# EasyEDA Pro project Charger Splitter.eprj, schematic Schematic2
Board Name: Board2; Create Date: 2025-09-04; Page Name: P1; Project Name: Charger Splitter; Schematic Name: Schematic2; Update Date: 2025-09-14; Company: EasyEDA.com; Page Size: A4; Version: V1.0
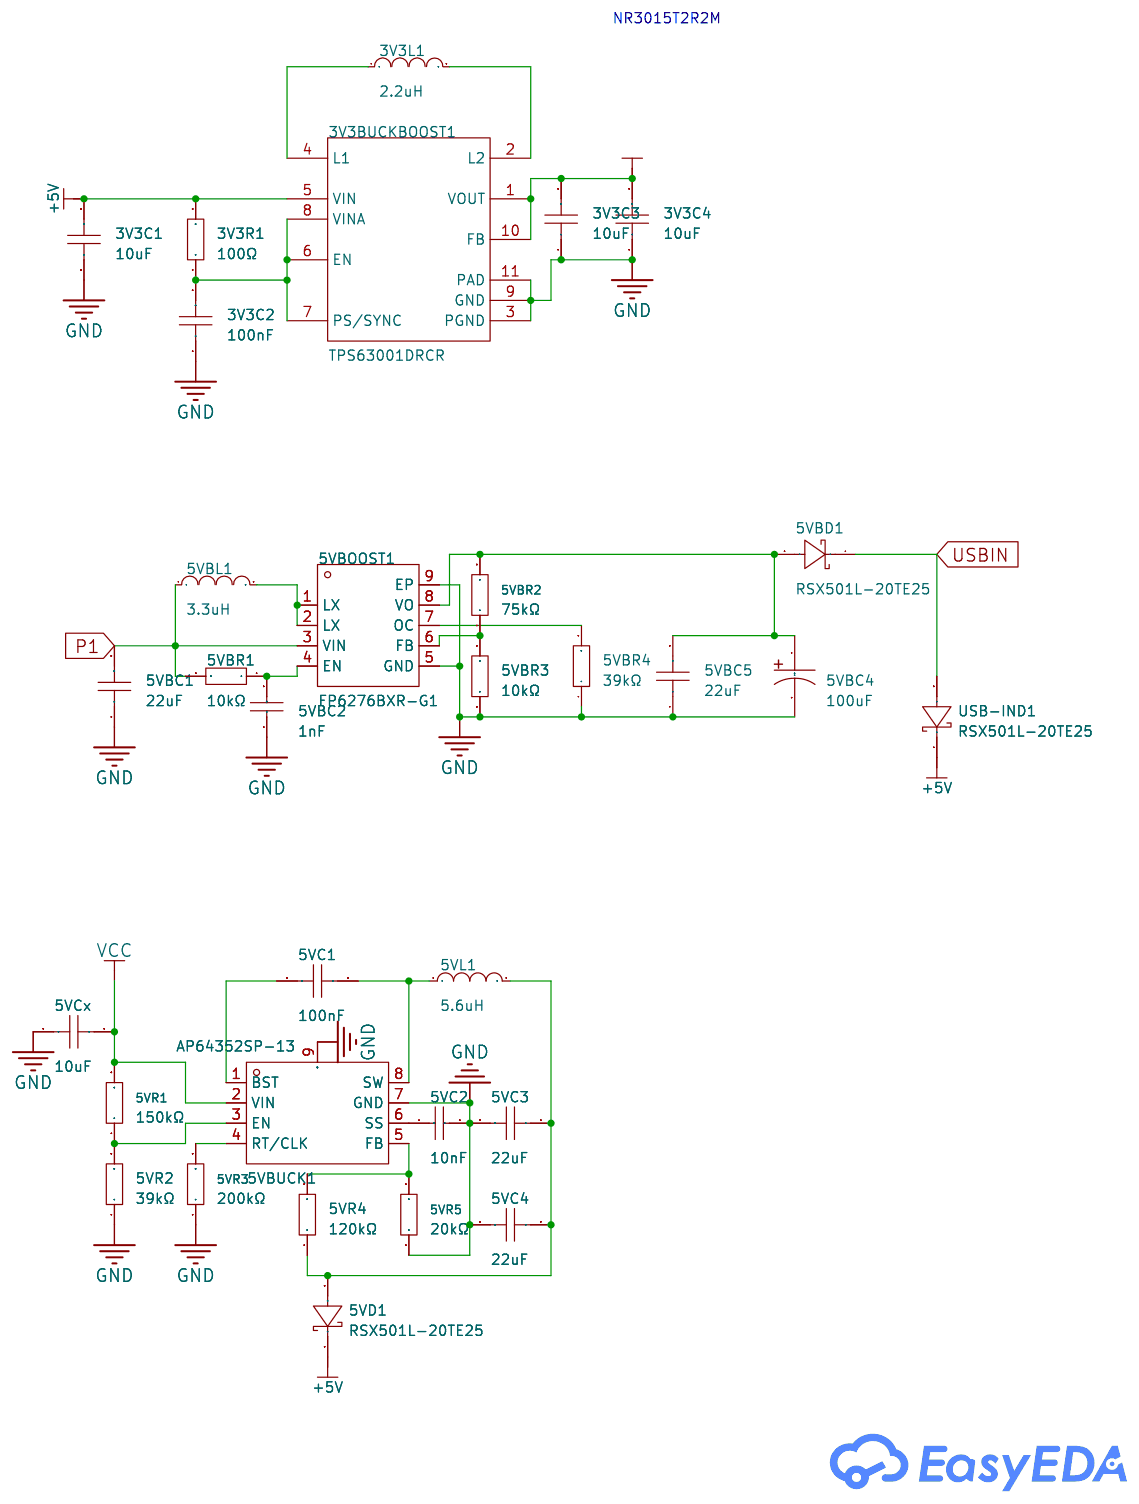
[diagram p1: schematic sheet]

## Parts
3V3BUCKBOOST1  TPS63001DRCR  [VSON-10_L3.0-W3.0-P0.50-TL-EP_TPS62410DRCR]
3V3C1  10uF  [C0805]
3V3C2  100nF  [C0805]
3V3C3  10uF  [C0805]
3V3C4  10uF  [C0805]
3V3L1  2.2uH  [IND-SMD_L3.0-W3.0_NR3010]
3V3R1  100Ω  [R0805]
5VBC1  22uF  [C0805]
5VBC2  1nF  [C0805]
5VBC4  100uF  [CAP-SMD_L3.5-W2.8-R-RD]
5VBC5  22uF  [C0805]
5VBD1  RSX501L-20TE25  [SMA_L4.5-W2.6-LS5.0-RD]
5VBL1  3.3uH  [IND-SMD_L7.0-W6.6]
5VBOOST1  FP6276BXR-G1  [SOP-8_L4.9-W3.9-P1.27-LS6.0-BL-EP]
5VBR1  10kΩ  [R0805]
5VBR2  75kΩ  [R0603]
5VBR3  10kΩ  [R0805]
5VBR4  39kΩ  [R0603]
5VBUCK1  AP64352SP-13  [SO-8_L4.9-W3.9-P1.27-LS6.0-BL-EP]
5VC1  100nF  [C0805]
5VC2  10nF  [C0805]
5VC3  22uF  [C0805]
5VC4  22uF  [C0805]
5VCx  10uF  [C0805]
5VD1  RSX501L-20TE25  [SMA_L4.5-W2.6-LS5.0-RD]
5VL1  5.6uH  [IND-SMD_L5.5-W5.3]
5VR1  150kΩ  [R0805]
5VR2  39kΩ  [R0603]
5VR3  200kΩ  [R0805]
5VR4  120kΩ  [R0603]
5VR5  20kΩ  [R0805]
USB-IND1  RSX501L-20TE25  [SMA_L4.5-W2.6-LS5.0-RD]

## Library data of the parts
3V3BUCKBOOST1 = TPS63001DRCR: Function:Boost type Output Type:Fixed Voltage - Supply:1.8V~5.5V Voltage - Supply:1.8V~5.5V Output Voltage:3.3V Output Voltage:3.3V Output Current:- Frequency - Switching:1.5MHz Frequency - Switching:1.5MHz Operating Temperature:-40℃~+85℃@(TA) Operating T; LCSC Part Name: 高效率单电感升降压转换器; Supplier Part: C28060; Manufacturer: TI(德州仪器); Supplier Footprint: VSON-10-EP(3x3); JLCPCB Part Class: Extended Part; Datasheet: https://www.ti.com/cn/lit/gpn/tps63001; Supplier: LCSC; Function: Boost type; Output Type: Fixed; Voltage - Supply: 1.8V~5.5V; Output Voltage: 3.3V; Frequency - Switching: 1.5MHz; Operating Temperature: -40℃~+85℃@(TA); Synchronous Rectifier: Yes; Number of Outputs: 1; Topology: Step-down-Boost; Switch tube (built-in/external): Built-in
3V3C1 3V3C3 3V3C4 = CL21A106KAYNNNE_C15850: Capacitance: Tolerance:±10% Tolerance:±10% Voltage Rated: Temperature Coefficient:; LCSC Part Name: 10uF ±10% 25V; Supplier Part: C15850; Manufacturer: SAMSUNG(三星); Manufacturer Part: CL21A106KAYNNNE; Supplier Footprint: 0805; JLCPCB Part Class: Basic Part; Datasheet: https://atta.szlcsc.com/upload/public/pdf/source/20160218/1457707763339.pdf; Supplier: LCSC; Tolerance: ±10%
3V3C2 5VC1 = CC0805KRX7R9BB104: Capacitance: Tolerance:±10% Tolerance:±10% Voltage Rated: Temperature Coefficient:; LCSC Part Name: 100nF ±10% 50V; Supplier Part: C49678; Manufacturer: YAGEO(国巨); Supplier Footprint: 0805; JLCPCB Part Class: Basic Part; Datasheet: https://atta.szlcsc.com/upload/public/pdf/source/20180224/C181747_15194369449651363981.pdf; Supplier: LCSC; Tolerance: ±10%
3V3L1 = NR3015T2R2M: LCSC Part Name: 2.2uH ±20% 1.48A 停产; Supplier Part: C86423; Manufacturer: TAIYO YUDEN(太诱); Supplier Footprint: SMD,3x3mm; JLCPCB Part Class: Extended Part; Datasheet: https://atta.szlcsc.com/upload/public/pdf/source/20210429/D283EEC4B2B32E0C06ACD7E308182B38.pdf; Supplier: LCSC; Tolerance: ±20%; Current - Saturation(Isat): 1.48A; DC Resistance(DCR): 72mΩ
3V3R1 = 0805W8F1000T5E_C17408: Type:Thick Film Resistors Resistance: Tolerance:±1% Tolerance:±1% Power(Watts): Overload Voltage (Max): Temperature Coefficient:±100ppm/℃ Temperature Coefficient:±100ppm/℃ Operating Temperature Range:-55℃~+155℃ Operating Temperature Range:-55℃~+155℃; LCSC Part Name: 100Ω ±1% 125mW 厚膜电阻; Supplier Part: C17408; Manufacturer: UNI-ROYAL(厚声); Manufacturer Part: 0805W8F1000T5E; Supplier Footprint: 0805; JLCPCB Part Class: Basic Part; Datasheet: https://atta.szlcsc.com/upload/public/pdf/source/20200306/C422600_1E6D84923E4A46A82E41ADD87F860B5C.pdf; Supplier: LCSC; Type: Thick Film Resistors; Tolerance: ±1%; Temperature Coefficient: ±100ppm/℃; Operating Temperature Range: -55℃~+155℃
5VBC1 5VBC5 5VC3 5VC4 = CL21A226MAQNNNE: LCSC Part Name: 22uF ±20% 25V; Supplier Part: C45783; Manufacturer: SAMSUNG(三星); Supplier Footprint: 0805; JLCPCB Part Class: Basic Part; Datasheet: https://item.szlcsc.com/datasheet/CL21A226MAQNNNE/46786.html; Supplier: LCSC; Tolerance: ±20%; Voltage Rating: 25V; Temperature Coefficient: X5R
5VBC2 = CL21B102KBCNNNC: Capacitance:1nF Tolerance:±10% Tolerance:±10% Voltage Rating:50V Temperature Coefficient:X7R; LCSC Part Name: 1nF ±10% 50V; Supplier Part: C46653; Manufacturer: SAMSUNG(三星); Supplier Footprint: 0805; JLCPCB Part Class: Basic Part; Datasheet: https://item.szlcsc.com/datasheet/CL21B102KBCNNNC/47657.html; Supplier: LCSC; Tolerance: ±10%; Voltage Rating: 50V; Temperature Coefficient: X7R
5VBC4 = CA45A-B-10V-100UF-K: Capacitance:100uF Tolerance:±10% Tolerance:±10% Voltage Rating:10V Operating Temperature:-55℃~+125℃ Operating Temperature:-55℃~+125℃; LCSC Part Name: 100uF ±10% 10V; Supplier Part: C2976906; Manufacturer: CEC(振华新云); Supplier Footprint: SMD,2.8x3.5mm; JLCPCB Part Class: Extended Part; Datasheet: https://atta.szlcsc.com/upload/public/pdf/source/20220222/C2C5F368BEBB90E653B4407F98E5644A.pdf; Supplier: LCSC; Tolerance: ±10%; Voltage Rating: 10V; Operating Temperature: -55℃~+125℃
5VBD1 5VD1 USB-IND1 = RSX501L-20TE25: Diode Configuration:Independent Voltage - Forward(Vf@If):390mV@3A Voltage - DC Reverse(Vr):20V Current - Rectified:5A Reverse Leakage Current (Ir):500uA@20V Non-Repetitive Peak Forward Surge Current:70A; LCSC Part Name: 电压:20V 电流:5A; Supplier Part: C329921; Manufacturer: ROHM(罗姆); Supplier Footprint: SMA; JLCPCB Part Class: Extended Part; Datasheet: https://item.szlcsc.com/datasheet/RSX501L-20TE25/309630.html; Supplier: LCSC; Diode Configuration: Independent; Voltage - Forward(Vf@If): 390mV@3A; Voltage - DC Reverse(Vr): 20V; Current - Rectified: 5A; Reverse Leakage Current (Ir): 500uA@20V; Non-Repetitive Peak Forward Surge Current: 70A
5VBL1 = FXL0630-3R3-M: Inductance: Tolerance:±20% Tolerance:±20% Rated Current: Saturation Current (Isat):9.5A DC Resistance (DCR): Type:Integrated molded inductor; LCSC Part Name: 3.3uH ±20% 9.5A; Supplier Part: C167219; Manufacturer: cjiang(长江微电); Supplier Footprint: SMD,6.6x7mm; JLCPCB Part Class: Extended Part; Datasheet: https://atta.szlcsc.com/upload/public/pdf/source/20240426/3189EA8206330E2108542F9E34E540E7.pdf; Supplier: LCSC; Tolerance: ±20%; Saturation Current (Isat): 9.5A; Type: Integrated molded inductor
5VBOOST1 = FP6276BXR-G1: Function:Boost type Output Type:Adjustable Input Voltage:2.4V~4.5V Input Voltage:2.4V~4.5V Output Voltage:- Output Voltage:- Output Current:6A Switching Frequency:500kHz Switching Frequency:500kHz Operating Temperature:-40℃~+85℃ Operating Temperature:-40℃; LCSC Part Name: 500kHz 6A高效同步PWM升压转换器; Supplier Part: C82652; Manufacturer: Advanced Analog Technology(类比); Supplier Footprint: SOP-8-EP; JLCPCB Part Class: Extended Part; Datasheet: https://atta.szlcsc.com/upload/public/pdf/source/20170315/1489573065037.pdf; Supplier: LCSC; Function: Boost type; Output Type: Adjustable; Input Voltage: 2.4V~4.5V; Output Current: 6A; Switching Frequency: 500kHz; Operating Temperature: -40℃~+85℃; Number of Outputs: 1; Topology: Boost; Quiescent Current (Iq): 280uA; Switch tube (built-in/external): Built-in
5VBR1 5VBR3 = 0805W8F1002T5E: Type:Thick Film Resistor Resistance:10kΩ Tolerance:±1% Tolerance:±1% Power(Watts):125mW Voltage-Supply(Max):150V Temperature Coefficient:±100ppm/℃ Temperature Coefficient:±100ppm/℃ Operating Temperature:-55℃~+155℃ Operating Temperature:-55℃~+155℃; LCSC Part Name: 10kΩ ±1% 125mW 厚膜电阻; Supplier Part: C17414; Manufacturer: UNI-ROYAL(厚声); Supplier Footprint: 0805; JLCPCB Part Class: Basic Part; Datasheet: https://item.szlcsc.com/datasheet/0805W8F1002T5E/18102.html; Supplier: LCSC; Type: Thick Film Resistor; Tolerance: ±1%; Power(Watts): 125mW; Voltage-Supply(Max): 150V; Temperature Coefficient: ±100ppm/℃; Operating Temperature: -55℃~+155℃
5VBR2 = 0603WAF7502T5E: LCSC Part Name: 75kΩ ±1% 100mW 厚膜电阻; Supplier Part: C23242; Manufacturer: UNI-ROYAL(厚声); Supplier Footprint: 0603; JLCPCB Part Class: Basic Part; Datasheet: https://item.szlcsc.com/datasheet/0603WAF7502T5E/23969.html; Supplier: LCSC; Type: Thick Film Resistor; Tolerance: ±1%; Power(Watts): 100mW; Voltage-Supply(Max): 75V; Temperature Coefficient: ±100ppm/℃; Operating Temperature: -55℃~+155℃
5VBR4 5VR2 = 0603WAF3902T5E: LCSC Part Name: 39kΩ ±1% 100mW 厚膜电阻; Supplier Part: C23153; Manufacturer: UNI-ROYAL(厚声); Supplier Footprint: 0603; JLCPCB Part Class: Basic Part; Datasheet: https://atta.szlcsc.com/upload/public/pdf/source/20200306/C422600_1E6D84923E4A46A82E41ADD87F860B5C.pdf; Supplier: LCSC; Type: Thick Film Resistors; Tolerance: ±1%; Temperature Coefficient: ±100ppm/℃; Operating Temperature Range: -55℃~+155℃
5VBUCK1 = AP64352SP-13: Function:Step-down type Output Type:- Voltage - Supply:3.8V~40V Voltage - Supply:3.8V~40V Output Voltage:- Output Voltage:- Output Current:3.5A Frequency - Switching:100kHz~2.2MHz Frequency - Switching:100kHz~2.2MHz Operating Temperature:-40℃~+85℃ Operati; LCSC Part Name: 3.8V至40V输入，3.5A低静态电流同步降压转换器; Supplier Part: C2071665; Manufacturer: DIODES(美台); Supplier Footprint: SO-8-EP; JLCPCB Part Class: Extended Part; Datasheet: https://atta.szlcsc.com/upload/public/pdf/source/20211207/6E33FF1B3B23FC2994BFD67B246A4BA4.pdf; Supplier: LCSC; Function: Step-down type; Voltage - Supply: 3.8V~40V; Output Current: 3.5A; Frequency - Switching: 100kHz~2.2MHz; Operating Temperature: -40℃~+85℃; Synchronous Rectifier: Yes; Number of Outputs: 1; Topology: Step-down; Switch tube (built-in/external): Built-in
5VC2 = CL21B103KBANNNC: Capacitance:10nF Tolerance:±10% Tolerance:±10% Voltage Rating:50V Temperature Coefficient:X7R; LCSC Part Name: 10nF ±10% 50V; Supplier Part: C1710; Manufacturer: SAMSUNG(三星); Supplier Footprint: 0805; JLCPCB Part Class: Basic Part; Datasheet: https://item.szlcsc.com/datasheet/CL21B103KBANNNC/2062.html; Supplier: LCSC; Tolerance: ±10%; Voltage Rating: 50V; Temperature Coefficient: X7R
5VCx = GRM21BR61H106KE43L: LCSC Part Name: 10uF ±10% 50V; Supplier Part: C440198; Manufacturer: muRata(村田); Supplier Footprint: 0805; JLCPCB Part Class: Basic Part; Datasheet: https://atta.szlcsc.com/upload/public/pdf/source/20230811/95AAE0C9AF55EDC31B7A4D8B733F534E.pdf; Supplier: LCSC; Tolerance: ±10%
5VL1 = FEXL0550A-5R6M: Inductance:5.6uH Tolerance:±20% Tolerance:±20% Current Rating:7.2A Current - Saturation(Isat):8.6A DC Resistance(DCR):24.2mΩ Type:- Ratings:AEC-Q200; LCSC Part Name: 5.6uH ±20% 8.6A 合金扁线超大电流，一体成型电感; Supplier Part: C5378514; Manufacturer: cjiang(长江微电); Supplier Footprint: SMD,5.5x5.3mm; JLCPCB Part Class: Extended Part; Datasheet: https://atta.szlcsc.com/upload/public/pdf/source/20240409/B9FA7ECCC3220F3F7C7BE8F7B1FCE238.pdf; Supplier: LCSC; Tolerance: ±20%; Current Rating: 7.2A; Current - Saturation(Isat): 8.6A; DC Resistance(DCR): 24.2mΩ; Ratings: AEC-Q200
5VR1 = 0805W8F1503T5E: LCSC Part Name: 150kΩ ±1% 125mW 厚膜电阻; Supplier Part: C17470; Manufacturer: UNI-ROYAL(厚声); Supplier Footprint: 0805; JLCPCB Part Class: Basic Part; Datasheet: https://atta.szlcsc.com/upload/public/pdf/source/20200306/C422600_1E6D84923E4A46A82E41ADD87F860B5C.pdf; Supplier: LCSC; Type: Thick Film Resistors; Tolerance: ±1%; Temperature Coefficient: ±100ppm/℃; Operating Temperature Range: -55℃~+155℃
5VR3 = 0805W8F2003T5E: Type:Thick Film Resistors Resistance:200kΩ Tolerance:±1% Tolerance:±1% Power(Watts): Overload Voltage (Max): Temperature Coefficient:±100ppm/℃ Temperature Coefficient:±100ppm/℃ Operating Temperature Range:-55℃~+155℃ Operating Temperature Range:-55℃~+155℃; LCSC Part Name: 200kΩ ±1% 125mW 厚膜电阻; Supplier Part: C17539; Manufacturer: UNI-ROYAL(厚声); Supplier Footprint: 0805; JLCPCB Part Class: Basic Part; Datasheet: https://atta.szlcsc.com/upload/public/pdf/source/20200306/C422600_1E6D84923E4A46A82E41ADD87F860B5C.pdf; Supplier: LCSC; Type: Thick Film Resistors; Tolerance: ±1%; Temperature Coefficient: ±100ppm/℃; Operating Temperature Range: -55℃~+155℃
5VR4 = 0603WAF1203T5E: LCSC Part Name: 120kΩ ±1% 100mW 厚膜电阻; Supplier Part: C25808; Manufacturer: UNI-ROYAL(厚声); Supplier Footprint: 0603; JLCPCB Part Class: Basic Part; Datasheet: https://item.szlcsc.com/datasheet/0603WAF1203T5E/26551.html; Supplier: LCSC; Type: Thick Film Resistor; Tolerance: ±1%; Power(Watts): 100mW; Voltage-Supply(Max): 75V; Temperature Coefficient: ±100ppm/℃; Operating Temperature: -55℃~+155℃
5VR5 = 0805W8F2002T5E: LCSC Part Name: 20kΩ ±1% 125mW 厚膜电阻; Supplier Part: C4328; Manufacturer: UNI-ROYAL(厚声); Supplier Footprint: 0805; JLCPCB Part Class: Basic Part; Datasheet: https://atta.szlcsc.com/upload/public/pdf/source/20200306/C422600_1E6D84923E4A46A82E41ADD87F860B5C.pdf; Supplier: LCSC; Type: Thick Film Resistors; Tolerance: ±1%; Temperature Coefficient: ±100ppm/℃; Operating Temperature Range: -55℃~+155℃

## Nets
3V3: 3V3BUCKBOOST1.1(VOUT) 3V3BUCKBOOST1.10(FB) 3V3C3.2 3V3C4.2
+5V: 3V3BUCKBOOST1.5(VIN) 3V3C1.2 3V3R1.2 5VD1.1(A) USB-IND1.1(A)
GND: 3V3BUCKBOOST1.3(PGND) 3V3BUCKBOOST1.9(GND) 3V3BUCKBOOST1.11(PAD) 3V3C1.1 3V3C2.1 3V3C3.1 3V3C4.1 5VBC1.1 5VBC2.1 5VBC4.2 5VBC5.1 5VBOOST1.5(GND) 5VBOOST1.9(EP) 5VBR3.2 5VBR4.1 5VBUCK1.7(GND) 5VBUCK1.9(PAD) 5VC2.2 5VC3.2 5VC4.2 5VCx.2 5VR2.1 5VR3.1 5VR5.1
VCC: 5VBUCK1.2(VIN) 5VCx.1 5VR1.2
P1: 5VBC1.2 5VBL1.1 5VBOOST1.3(VIN) 5VBR1.2
USBIN: 5VBD1.1(A) USB-IND1.2(K)
$1N2362: 3V3BUCKBOOST1.6(EN) 3V3BUCKBOOST1.7(PS/SYNC) 3V3BUCKBOOST1.8(VINA) 3V3C2.2 3V3R1.1
$1N2363: 3V3BUCKBOOST1.4(L1) 3V3L1.1
$1N2366: 3V3BUCKBOOST1.2(L2) 3V3L1.2
$1N2893: 5VC3.1 5VC4.1 5VD1.2(K) 5VL1.2 5VR4.1
$1N2896: 5VBUCK1.6(SS) 5VC2.1
$1N2899: 5VBUCK1.5(FB) 5VR4.2 5VR5.2
$1N2901: 5VBUCK1.3(EN) 5VR1.1 5VR2.2
$1N2902: 5VBUCK1.4(RT/CLK) 5VR3.2
$1N2903: 5VBUCK1.1(BST) 5VC1.2
$1N2904: 5VBUCK1.8(SW) 5VC1.1 5VL1.1
$1N3426: 5VBC4.1 5VBC5.2 5VBD1.2(K) 5VBOOST1.8(VO) 5VBR2.2
$1N3427: 5VBOOST1.6(FB) 5VBR2.1 5VBR3.1
$1N3428: 5VBL1.2 5VBOOST1.1(LX) 5VBOOST1.2(LX)
$1N3429: 5VBC2.2 5VBOOST1.4(EN) 5VBR1.1
$1N3432: 5VBOOST1.7(OC) 5VBR4.2

## Notes on the sheet
- NR3015T2R2M
